# EAGLE schematic calendar-module (EAGLE 7.7.0)
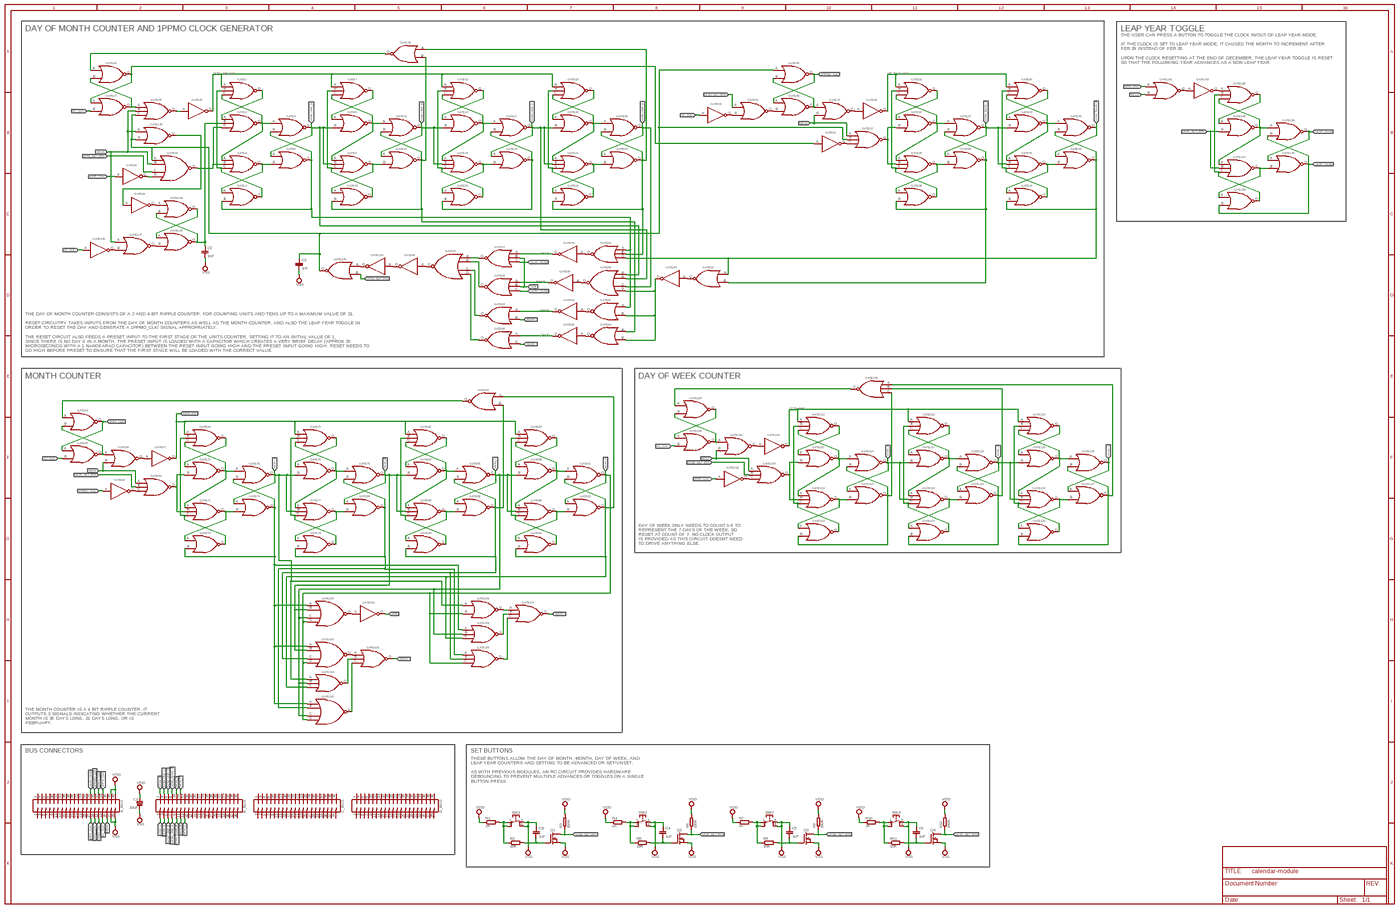
[diagram p0: schematic, sheet 1, overview]
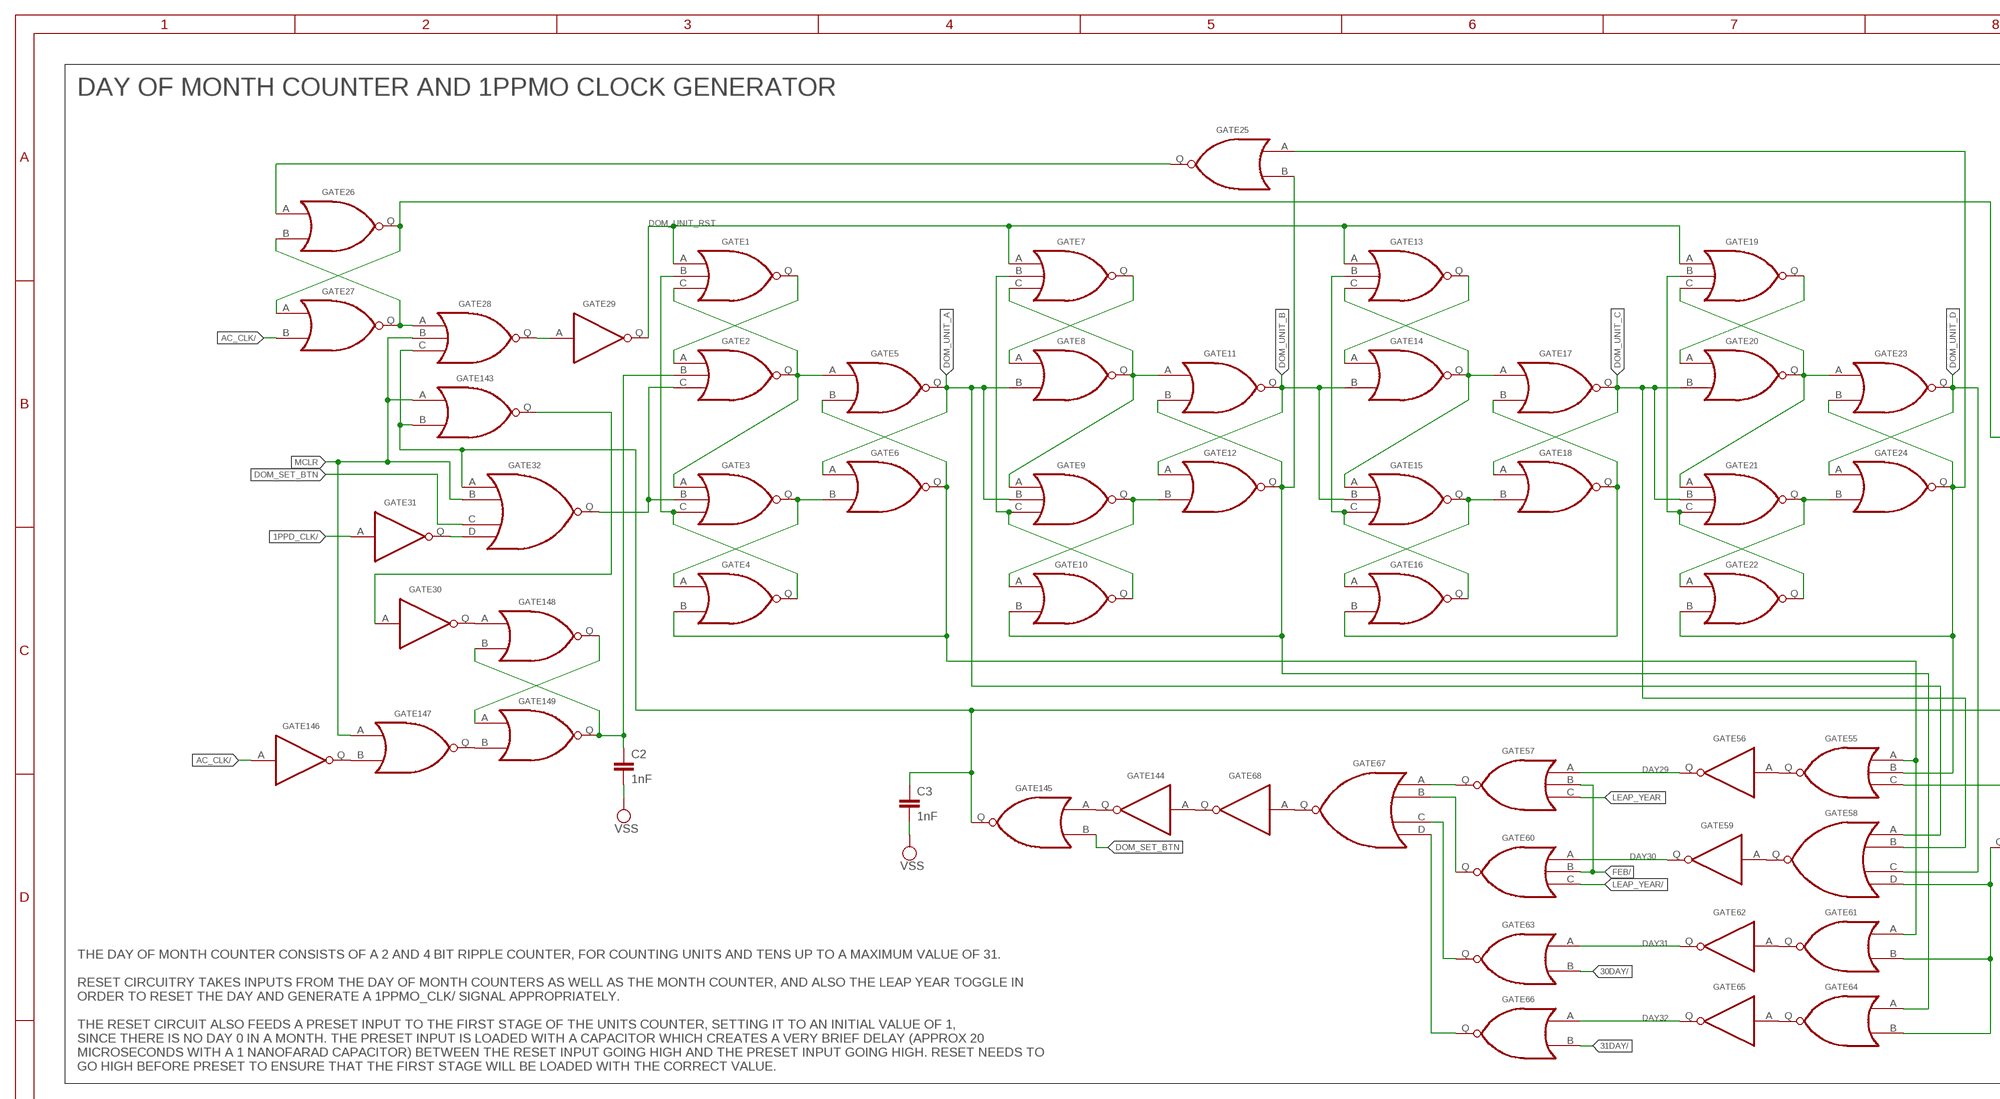
[diagram p1: schematic, sheet 1, part 1 of 4]
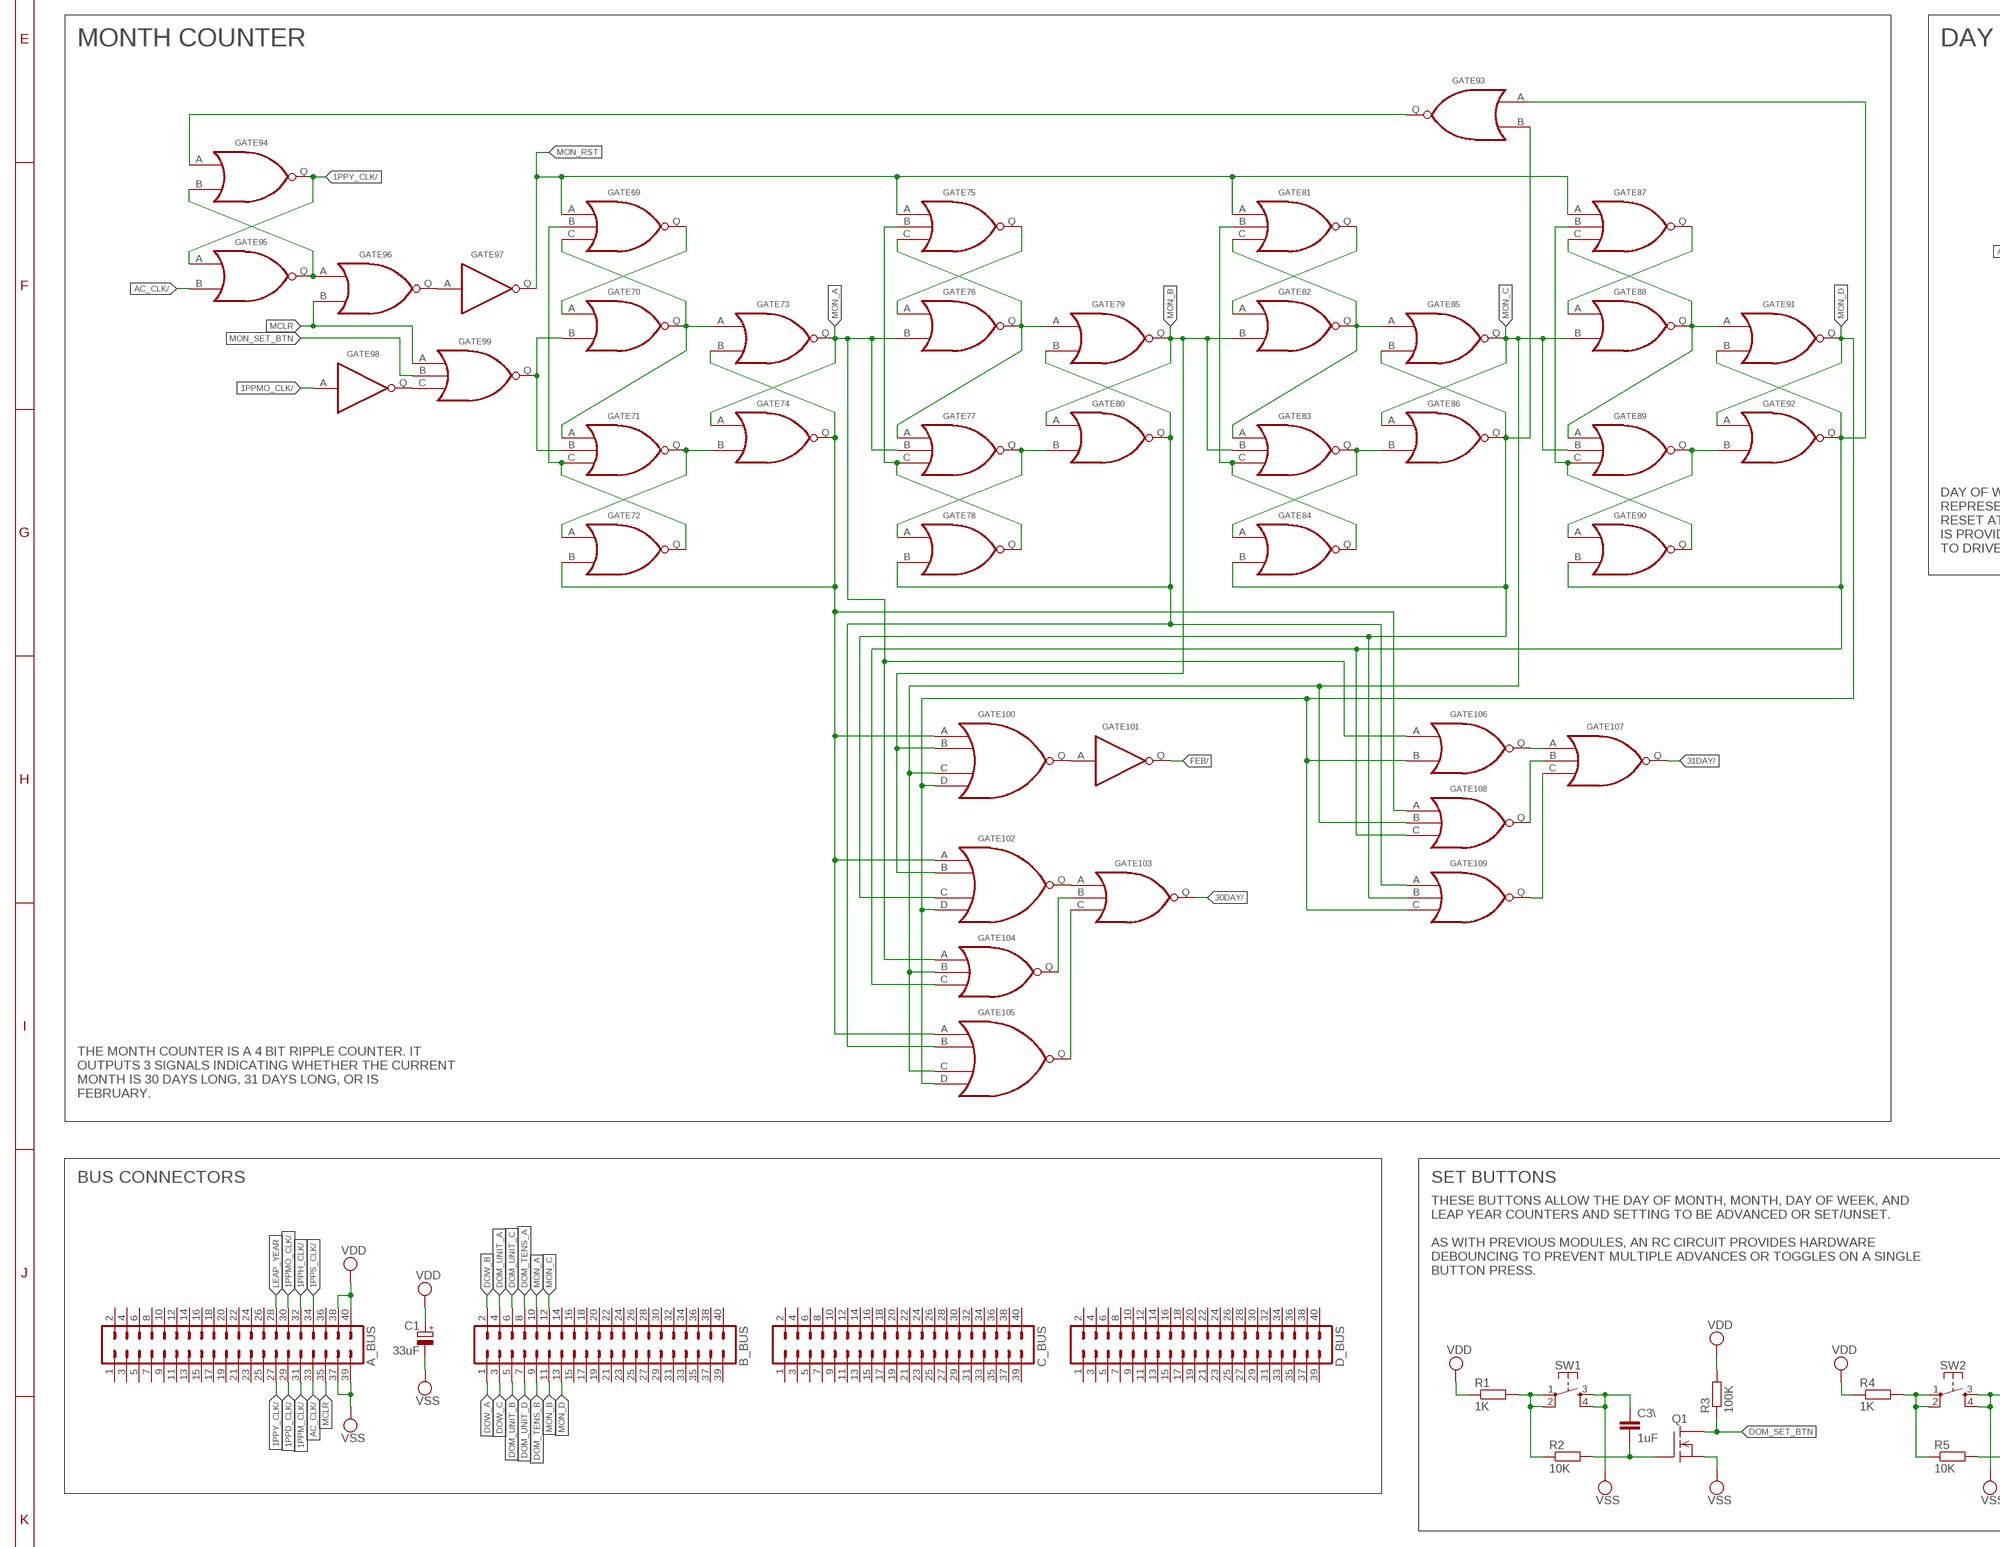
[diagram p2: schematic, sheet 1, part 2 of 4]
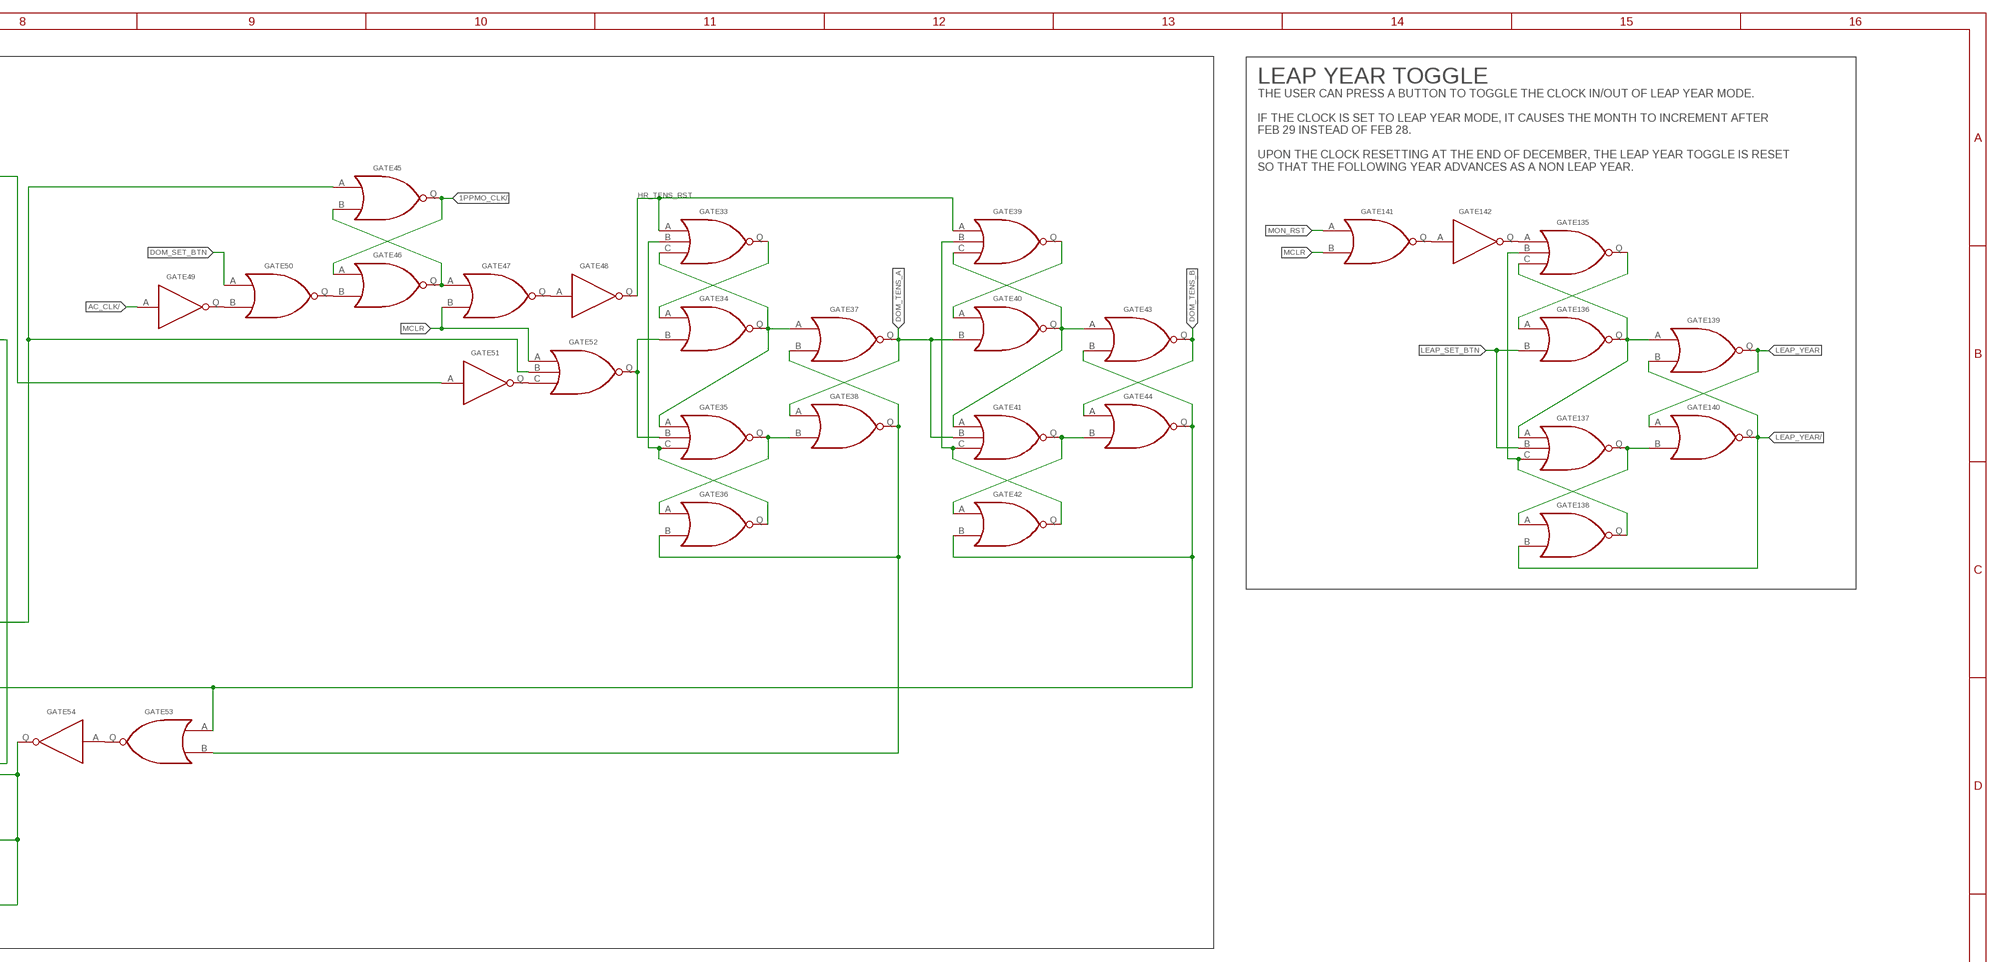
[diagram p3: schematic, sheet 1, part 3 of 4]
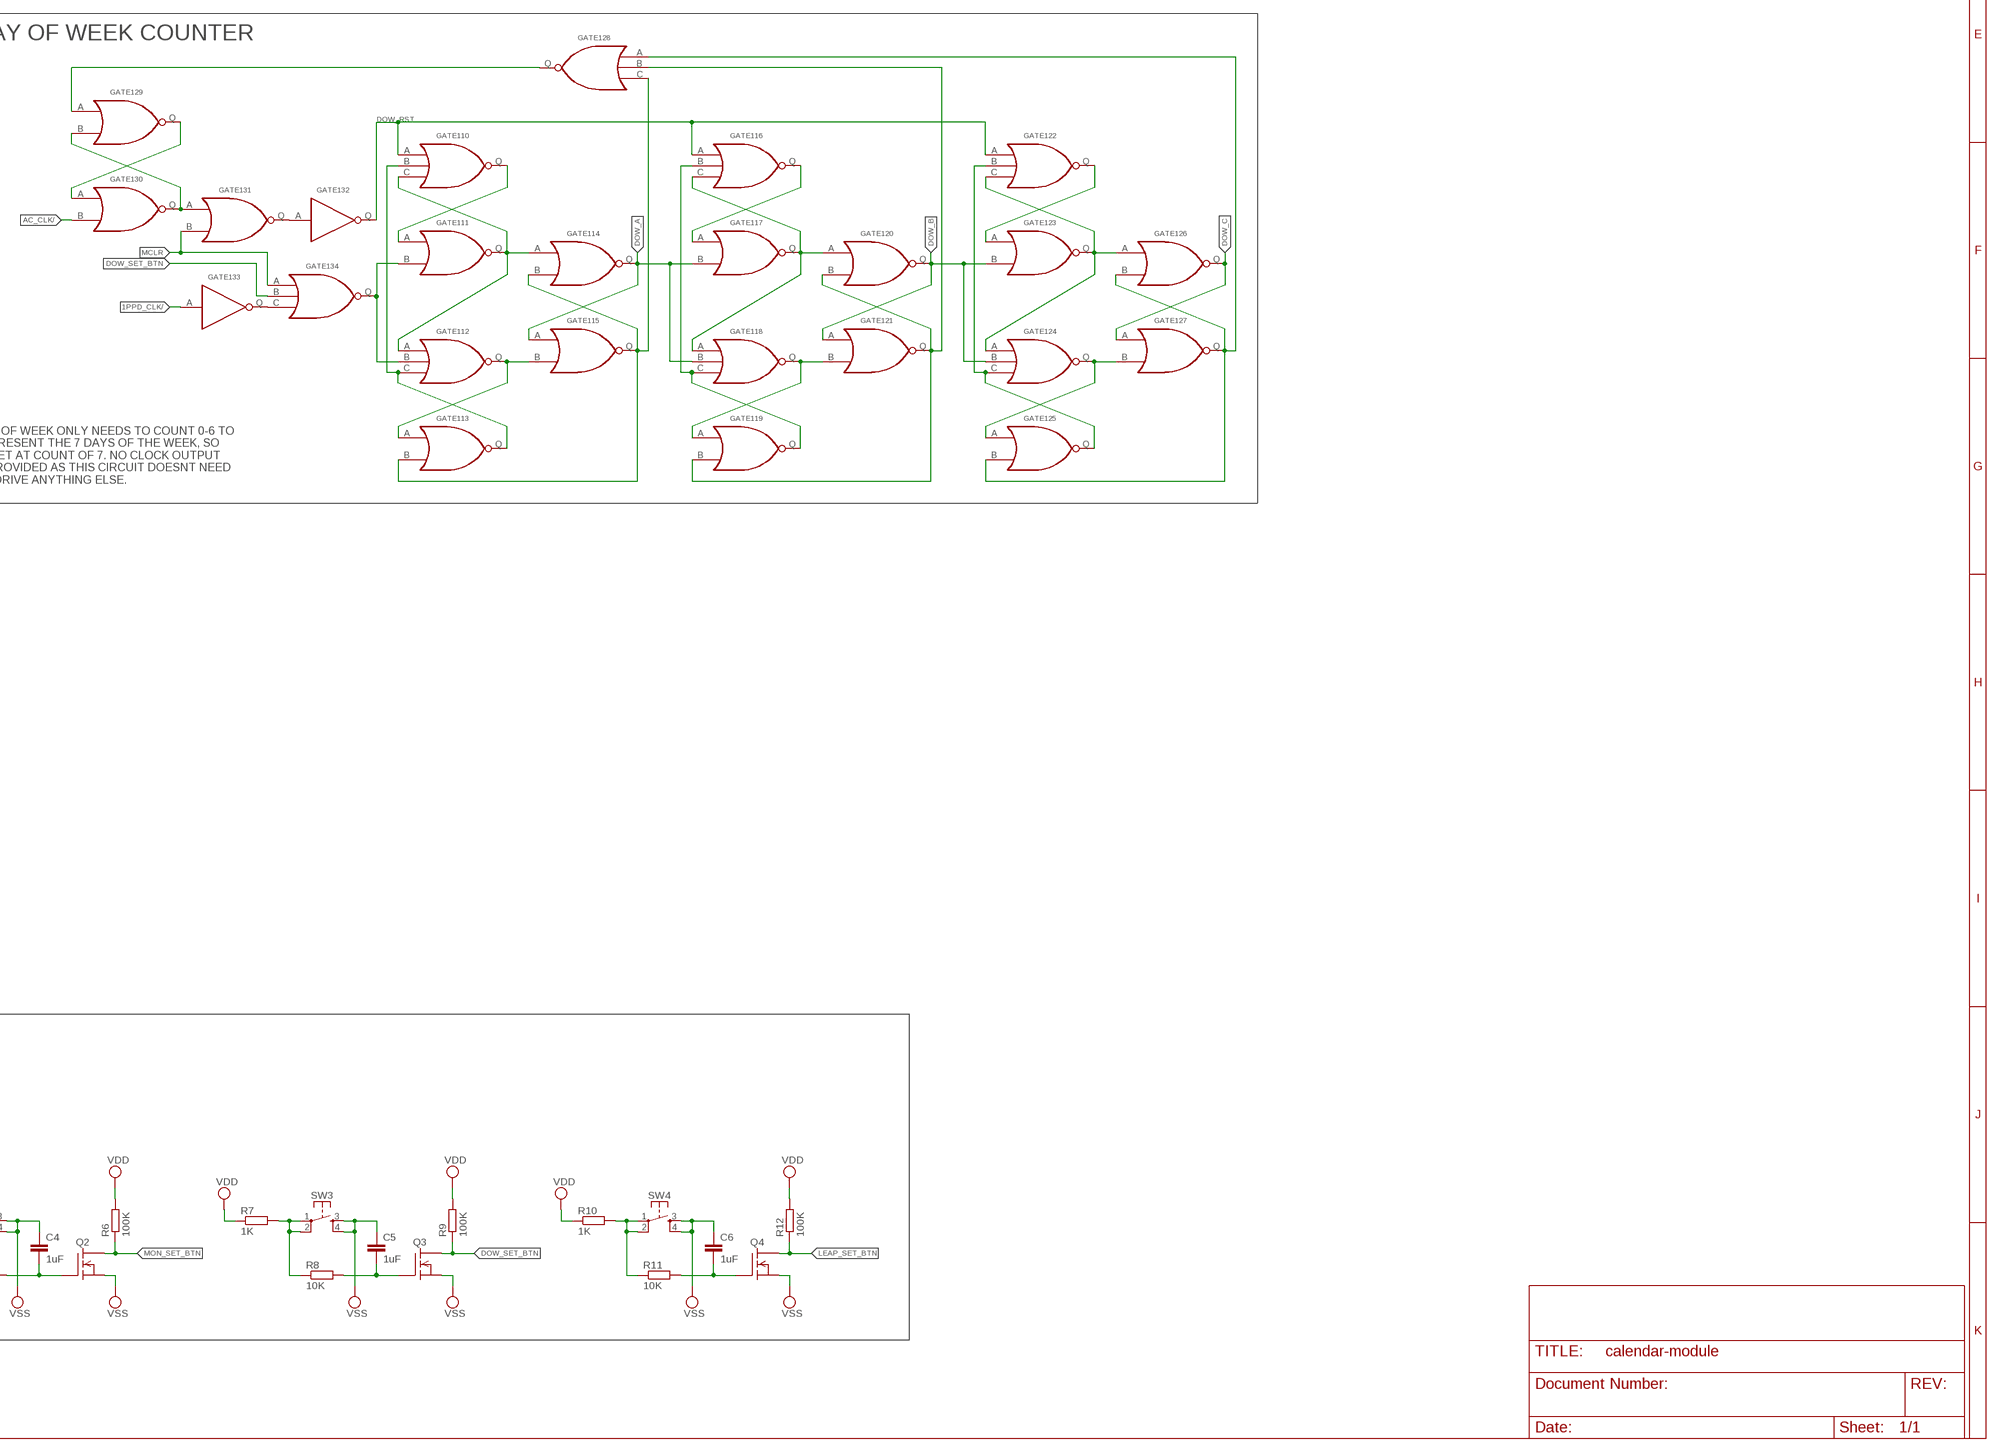
[diagram p4: schematic, sheet 1, part 4 of 4]

## Parts
A_BUS  MA20-2  [MA20-2]
B_BUS  MA20-2  [MA20-2]
C1  33uF  CPOL-EUE2.5-6  [E2,5-6]
C2  1nF  C-EU050-025X075  [C050-025X075]
C3  1nF  C-EU050-025X075  [C050-025X075]
C3\  1uF  C-EU050-025X075  [C050-025X075]
C4  1uF  C-EU050-025X075  [C050-025X075]
C5  1uF  C-EU050-025X075  [C050-025X075]
C6  1uF  C-EU050-025X075  [C050-025X075]
C_BUS  MA20-2  [MA20-2]
D_BUS  MA20-2  [MA20-2]
GATE1  3NOR  [3NOR]
GATE2  3NOR  [3NOR]
GATE3  3NOR  [3NOR]
GATE4  2NOR  [2NOR]
GATE5  2NOR  [2NOR]
GATE6  2NOR  [2NOR]
GATE7  3NOR  [3NOR]
GATE8  2NOR  [2NOR]
GATE9  3NOR  [3NOR]
GATE10  2NOR  [2NOR]
GATE11  2NOR  [2NOR]
GATE12  2NOR  [2NOR]
GATE13  3NOR  [3NOR]
GATE14  2NOR  [2NOR]
GATE15  3NOR  [3NOR]
GATE16  2NOR  [2NOR]
GATE17  2NOR  [2NOR]
GATE18  2NOR  [2NOR]
GATE19  3NOR  [3NOR]
GATE20  2NOR  [2NOR]
GATE21  3NOR  [3NOR]
GATE22  2NOR  [2NOR]
GATE23  2NOR  [2NOR]
GATE24  2NOR  [2NOR]
GATE25  2NOR  [2NOR]
GATE26  2NOR  [2NOR]
GATE27  2NOR  [2NOR]
GATE28  3NOR  [3NOR]
GATE29  INVERTER  [INVERTER]
GATE30  INVERTER  [INVERTER]
GATE31  INVERTER  [INVERTER]
GATE32  4NOR  [4NOR]
GATE33  3NOR  [3NOR]
GATE34  2NOR  [2NOR]
GATE35  3NOR  [3NOR]
GATE36  2NOR  [2NOR]
GATE37  2NOR  [2NOR]
GATE38  2NOR  [2NOR]
GATE39  3NOR  [3NOR]
GATE40  2NOR  [2NOR]
GATE41  3NOR  [3NOR]
GATE42  2NOR  [2NOR]
GATE43  2NOR  [2NOR]
GATE44  2NOR  [2NOR]
GATE45  2NOR  [2NOR]
GATE46  2NOR  [2NOR]
GATE47  2NOR  [2NOR]
GATE48  INVERTER  [INVERTER]
GATE49  INVERTER  [INVERTER]
GATE50  2NOR  [2NOR]
GATE51  INVERTER  [INVERTER]
GATE52  3NOR  [3NOR]
GATE53  2NOR  [2NOR]
GATE54  INVERTER  [INVERTER]
GATE55  3NOR  [3NOR]
GATE56  INVERTER  [INVERTER]
GATE57  3NOR  [3NOR]
GATE58  4NOR  [4NOR]
GATE59  INVERTER  [INVERTER]
GATE60  3NOR  [3NOR]
GATE61  2NOR  [2NOR]
GATE62  INVERTER  [INVERTER]
GATE63  2NOR  [2NOR]
GATE64  2NOR  [2NOR]
GATE65  INVERTER  [INVERTER]
GATE66  2NOR  [2NOR]
GATE67  4NOR  [4NOR]
GATE68  INVERTER  [INVERTER]
GATE69  3NOR  [3NOR]
GATE70  2NOR  [2NOR]
GATE71  3NOR  [3NOR]
GATE72  2NOR  [2NOR]
GATE73  2NOR  [2NOR]
GATE74  2NOR  [2NOR]
GATE75  3NOR  [3NOR]
GATE76  2NOR  [2NOR]
GATE77  3NOR  [3NOR]
GATE78  2NOR  [2NOR]
GATE79  2NOR  [2NOR]
GATE80  2NOR  [2NOR]
GATE81  3NOR  [3NOR]
GATE82  2NOR  [2NOR]
GATE83  3NOR  [3NOR]
GATE84  2NOR  [2NOR]
GATE85  2NOR  [2NOR]
GATE86  2NOR  [2NOR]
GATE87  3NOR  [3NOR]
GATE88  2NOR  [2NOR]
GATE89  3NOR  [3NOR]
GATE90  2NOR  [2NOR]
GATE91  2NOR  [2NOR]
GATE92  2NOR  [2NOR]
GATE93  2NOR  [2NOR]
GATE94  2NOR  [2NOR]
GATE95  2NOR  [2NOR]
GATE96  2NOR  [2NOR]
GATE97  INVERTER  [INVERTER]
GATE98  INVERTER  [INVERTER]
GATE99  3NOR  [3NOR]
GATE100  4NOR  [4NOR]
GATE101  INVERTER  [INVERTER]
GATE102  4NOR  [4NOR]
GATE103  3NOR  [3NOR]
GATE104  3NOR  [3NOR]
GATE105  4NOR  [4NOR]
GATE106  2NOR  [2NOR]
GATE107  3NOR  [3NOR]
GATE108  3NOR  [3NOR]
GATE109  3NOR  [3NOR]
GATE110  3NOR  [3NOR]
GATE111  2NOR  [2NOR]
GATE112  3NOR  [3NOR]
GATE113  2NOR  [2NOR]
GATE114  2NOR  [2NOR]
GATE115  2NOR  [2NOR]
GATE116  3NOR  [3NOR]
GATE117  2NOR  [2NOR]
GATE118  3NOR  [3NOR]
GATE119  2NOR  [2NOR]
GATE120  2NOR  [2NOR]
GATE121  2NOR  [2NOR]
GATE122  3NOR  [3NOR]
GATE123  2NOR  [2NOR]
GATE124  3NOR  [3NOR]
GATE125  2NOR  [2NOR]
GATE126  2NOR  [2NOR]
GATE127  2NOR  [2NOR]
GATE128  3NOR  [3NOR]
GATE129  2NOR  [2NOR]
GATE130  2NOR  [2NOR]
GATE131  2NOR  [2NOR]
GATE132  INVERTER  [INVERTER]
GATE133  INVERTER  [INVERTER]
GATE134  3NOR  [3NOR]
GATE135  3NOR  [3NOR]
GATE136  2NOR  [2NOR]
GATE137  3NOR  [3NOR]
GATE138  2NOR  [2NOR]
GATE139  2NOR  [2NOR]
GATE140  2NOR  [2NOR]
GATE141  2NOR  [2NOR]
GATE142  INVERTER  [INVERTER]
GATE143  2NOR  [2NOR]
GATE144  INVERTER  [INVERTER]
GATE145  2NOR  [2NOR]
GATE146  INVERTER  [INVERTER]
GATE147  2NOR  [2NOR]
GATE148  2NOR  [2NOR]
GATE149  2NOR  [2NOR]
Q1  2N7000  [TO-92]
Q2  2N7000  [TO-92]
Q3  2N7000  [TO-92]
Q4  2N7000  [TO-92]
R1  1K  R-EU_0207/2V  [0207/2V]
R2  10K  R-EU_0207/2V  [0207/2V]
R3  100K  R-EU_0207/2V  [0207/2V]
R4  1K  R-EU_0207/2V  [0207/2V]
R5  10K  R-EU_0207/2V  [0207/2V]
R6  100K  R-EU_0207/2V  [0207/2V]
R7  1K  R-EU_0207/2V  [0207/2V]
R8  10K  R-EU_0207/2V  [0207/2V]
R9  100K  R-EU_0207/2V  [0207/2V]
R10  1K  R-EU_0207/2V  [0207/2V]
R11  10K  R-EU_0207/2V  [0207/2V]
R12  100K  R-EU_0207/2V  [0207/2V]
SW1  SPST-TACSWITCH  [TE-SMD-TACSWITCH]
SW2  SPST-TACSWITCH  [TE-SMD-TACSWITCH]
SW3  SPST-TACSWITCH  [TE-SMD-TACSWITCH]
SW4  SPST-TACSWITCH  [TE-SMD-TACSWITCH]

## Nets
1PPD_CLK/: A_BUS.29 GATE31.A GATE133.A
1PPH_CLK/: A_BUS.32
1PPM_CLK/: A_BUS.31
1PPMO_CLK/: A_BUS.30 GATE45.Q GATE46.A GATE98.A
1PPS_CLK/: A_BUS.34
1PPY_CLK/: A_BUS.27 GATE94.Q GATE95.A
30DAY/: GATE63.B GATE103.Q
31DAY/: GATE66.B GATE107.Q
AC_CLK/: A_BUS.33 GATE27.B GATE49.A GATE95.B GATE130.B GATE146.A
DAY29: GATE56.Q GATE57.A
DAY30: GATE59.Q GATE60.A
DAY31: GATE62.Q GATE63.A
DAY32: GATE65.Q GATE66.A
DOM_RESET: C3.1 GATE28.C GATE32.A GATE45.A GATE52.B GATE143.B GATE145.Q
DOM_SET_BTN: GATE32.C GATE50.A GATE145.B Q1.3(D) R3.1
DOM_TENS_A: B_BUS.8 GATE37.Q GATE38.A GATE40.B GATE41.B
DOM_TENS_B: B_BUS.9 GATE43.Q GATE44.A
DOM_UNIT_A: B_BUS.4 GATE5.Q GATE6.A GATE8.B GATE9.B GATE58.A
DOM_UNIT_B: B_BUS.5 GATE11.Q GATE12.A GATE14.B GATE15.B
DOM_UNIT_C: B_BUS.6 GATE17.Q GATE18.A GATE20.B GATE21.B GATE58.B
DOM_UNIT_D: B_BUS.7 GATE23.Q GATE24.A GATE58.C
DOM_UNIT_RST: GATE1.A GATE7.A GATE13.A GATE19.A GATE29.Q
DOM_UNIT_RST/: GATE26.Q GATE27.A GATE51.A
DOW_A: B_BUS.1 GATE114.Q GATE115.A GATE117.B GATE118.B
DOW_B: B_BUS.2 GATE120.Q GATE121.A GATE123.B GATE124.B
DOW_C: B_BUS.3 GATE126.Q GATE127.A
DOW_RST: GATE110.A GATE116.A GATE122.A GATE132.Q
DOW_SET_BTN: GATE134.B Q3.3(D) R9.1
FEB/: GATE57.B GATE60.B GATE101.Q
HR_TENS_RST: GATE33.A GATE39.A GATE48.Q
LEAP_SET_BTN: GATE136.B GATE137.B Q4.3(D) R12.1
LEAP_YEAR: A_BUS.28 GATE57.C GATE139.Q GATE140.A
LEAP_YEAR/: GATE60.C GATE138.B GATE139.B GATE140.Q
MCLR: A_BUS.35 GATE28.B GATE32.B GATE47.B GATE52.A GATE96.B GATE99.A GATE131.B GATE134.A GATE141.B GATE143.A GATE147.A
MON_A: B_BUS.10 GATE73.Q GATE74.A GATE76.B GATE77.B GATE104.A GATE106.A
MON_B: B_BUS.11 GATE79.Q GATE80.A GATE82.B GATE83.B GATE100.B GATE102.B
MON_C: B_BUS.12 GATE85.Q GATE86.A GATE88.B GATE89.B GATE100.C GATE104.B GATE105.C GATE108.B
MON_D: B_BUS.13 GATE91.Q GATE92.A GATE100.D GATE102.D GATE105.D GATE106.B GATE109.C
MON_RST: GATE69.A GATE75.A GATE81.A GATE87.A GATE97.Q GATE141.A
MON_SET_BTN: GATE99.B Q2.3(D) R6.1
N$1: GATE28.Q GATE29.A
N$2: GATE45.B GATE46.Q GATE47.A
N$3: GATE47.Q GATE48.A
N$4: GATE129.B GATE130.Q GATE131.A
N$5: GATE46.B GATE50.Q
N$6: GATE49.Q GATE50.B
N$7: GATE51.Q GATE52.C
N$8: GATE53.Q GATE54.A
N$9: GATE58.Q GATE59.A
N$10: GATE61.Q GATE62.A
N$11: GATE96.Q GATE97.A
N$12: GATE2.C GATE3.B GATE32.Q
N$13: GATE98.Q GATE99.C
N$14: GATE69.C GATE70.Q GATE71.A GATE73.A
N$15: GATE69.Q GATE70.A
N$16: GATE69.B GATE71.C GATE72.Q
N$17: GATE71.Q GATE72.A GATE74.B
N$18: GATE72.B GATE73.B GATE74.Q GATE100.A GATE102.A GATE105.A GATE108.A
N$19: GATE75.C GATE76.Q GATE77.A GATE79.A
N$20: GATE75.Q GATE76.A
N$21: GATE75.B GATE77.C GATE78.Q
N$22: GATE77.Q GATE78.A GATE80.B
N$23: GATE78.B GATE79.B GATE80.Q GATE105.B GATE109.A
N$24: GATE81.C GATE82.Q GATE83.A GATE85.A
N$25: GATE81.Q GATE82.A
N$26: GATE100.Q GATE101.A
N$27: GATE81.B GATE83.C GATE84.Q
N$28: GATE83.Q GATE84.A GATE86.B
N$29: GATE84.B GATE85.B GATE86.Q GATE93.B GATE102.C GATE109.B
N$30: GATE87.C GATE88.Q GATE89.A GATE91.A
N$31: GATE54.Q GATE58.D GATE61.B GATE64.B
N$32: GATE87.Q GATE88.A
N$33: GATE87.B GATE89.C GATE90.Q
N$34: GATE89.Q GATE90.A GATE92.B
N$35: GATE90.B GATE91.B GATE92.Q GATE93.A GATE104.C GATE108.C
N$36: GATE131.Q GATE132.A
N$37: GATE94.B GATE95.Q GATE96.A
N$38: GATE146.Q GATE147.B
N$39: GATE133.Q GATE134.C
N$40: GATE135.A GATE142.Q
N$41: GATE103.B GATE104.Q
N$42: GATE103.C GATE105.Q
N$43: GATE106.Q GATE107.A
N$44: GATE107.B GATE108.Q
N$45: GATE107.C GATE109.Q
N$46: GATE26.B GATE27.Q GATE28.A
N$47: GATE31.Q GATE32.D
N$48: GATE34.B GATE35.B GATE52.Q
N$49: GATE110.C GATE111.Q GATE112.A GATE114.A
N$50: GATE110.Q GATE111.A
N$51: GATE110.B GATE112.C GATE113.Q
N$52: GATE112.Q GATE113.A GATE115.B
N$53: GATE93.Q GATE94.A
N$54: GATE113.B GATE114.B GATE115.Q GATE128.C
N$55: GATE116.C GATE117.Q GATE118.A GATE120.A
N$56: GATE116.Q GATE117.A
N$57: GATE148.Q GATE149.A
N$58: GATE116.B GATE118.C GATE119.Q
N$59: GATE118.Q GATE119.A GATE121.B
N$60: GATE119.B GATE120.B GATE121.Q GATE128.B
N$61: GATE122.C GATE123.Q GATE124.A GATE126.A
N$62: C2.1 GATE2.B GATE148.B GATE149.Q
N$63: GATE122.Q GATE123.A
N$64: GATE122.B GATE124.C GATE125.Q
N$65: GATE124.Q GATE125.A GATE127.B
N$66: GATE57.Q GATE67.A
N$67: GATE60.Q GATE67.B
N$68: GATE63.Q GATE67.C
N$69: GATE68.Q GATE144.A
N$70: GATE144.Q GATE145.A
N$71: GATE125.B GATE126.B GATE127.Q GATE128.A
N$72: GATE128.Q GATE129.A
N$73: GATE66.Q GATE67.D
N$74: GATE55.Q GATE56.A
N$75: GATE70.B GATE71.B GATE99.Q
N$76: GATE147.Q GATE149.B
N$77: GATE129.Q GATE130.A
N$78: GATE102.Q GATE103.A
N$79: GATE111.B GATE112.B GATE134.Q
N$80: GATE135.C GATE136.Q GATE137.A GATE139.A
N$81: GATE135.Q GATE136.A
N$82: GATE135.B GATE137.C GATE138.Q
N$83: GATE1.C GATE2.Q GATE3.A GATE5.A
N$84: GATE1.Q GATE2.A
N$85: GATE1.B GATE3.C GATE4.Q
N$86: GATE3.Q GATE4.A GATE6.B
N$87: GATE4.B GATE5.B GATE6.Q GATE55.A GATE61.A
N$88: GATE7.C GATE8.Q GATE9.A GATE11.A
N$89: GATE7.Q GATE8.A
N$90: GATE7.B GATE9.C GATE10.Q
N$91: GATE9.Q GATE10.A GATE12.B
N$92: GATE10.B GATE11.B GATE12.Q GATE25.B GATE64.A
N$93: GATE13.C GATE14.Q GATE15.A GATE17.A
N$94: GATE13.Q GATE14.A
N$95: GATE13.B GATE15.C GATE16.Q
N$96: GATE15.Q GATE16.A GATE18.B
N$97: GATE16.B GATE17.B GATE18.Q
N$98: GATE19.C GATE20.Q GATE21.A GATE23.A
N$99: GATE19.Q GATE20.A
N$100: GATE19.B GATE21.C GATE22.Q
N$101: GATE21.Q GATE22.A GATE24.B
N$102: GATE22.B GATE23.B GATE24.Q GATE25.A GATE55.B
N$103: GATE25.Q GATE26.A
N$104: GATE137.Q GATE138.A GATE140.B
N$105: GATE141.Q GATE142.A
N$106: GATE64.Q GATE65.A
N$107: GATE67.Q GATE68.A
N$108: GATE33.C GATE34.Q GATE35.A GATE37.A
N$109: GATE33.Q GATE34.A
N$110: GATE33.B GATE35.C GATE36.Q
N$111: GATE35.Q GATE36.A GATE38.B
N$112: GATE36.B GATE37.B GATE38.Q GATE53.B
N$113: GATE39.C GATE40.Q GATE41.A GATE43.A
N$114: GATE39.Q GATE40.A
N$115: GATE39.B GATE41.C GATE42.Q
N$116: GATE41.Q GATE42.A GATE44.B
N$117: GATE30.Q GATE148.A
N$118: R4.2 R5.1 SW2.1 SW2.2
N$119: C4.2 Q2.2(G) R5.2
N$120: GATE42.B GATE43.B GATE44.Q GATE53.A GATE55.C
N$121: R7.2 R8.1 SW3.1 SW3.2
N$122: R1.2 R2.1 SW1.1 SW1.2
N$123: C5.2 Q3.2(G) R8.2
N$124: R10.2 R11.1 SW4.1 SW4.2
N$125: C6.2 Q4.2(G) R11.2
N$126: GATE30.A GATE143.Q
N$133: C3\.2 Q1.2(G) R2.2
VDD: A_BUS.38 A_BUS.40 C1.+ R1.1 R3.2 R4.1 R6.2 R7.1 R9.2 R10.1 R12.2
VSS: A_BUS.37 A_BUS.39 C1.- C2.2 C3.2 C3\.1 C4.1 C5.1 C6.1 Q1.1(S) Q2.1(S) Q3.1(S) Q4.1(S) SW1.3 SW1.4 SW2.3 SW2.4 SW3.3 SW3.4 SW4.3 SW4.4
Unconnected: A_BUS.1 A_BUS.2 A_BUS.3 A_BUS.4 A_BUS.5 A_BUS.6 A_BUS.7 A_BUS.8 A_BUS.9 A_BUS.10 A_BUS.11 A_BUS.12 A_BUS.13 A_BUS.14 A_BUS.15 A_BUS.16 A_BUS.17 A_BUS.18 A_BUS.19 A_BUS.20 A_BUS.21 A_BUS.22 A_BUS.23 A_BUS.24 A_BUS.25 A_BUS.26 A_BUS.36 B_BUS.14 B_BUS.15 B_BUS.16 B_BUS.17 B_BUS.18 B_BUS.19 B_BUS.20 B_BUS.21 B_BUS.22 B_BUS.23 B_BUS.24 B_BUS.25 B_BUS.26 B_BUS.27 B_BUS.28 B_BUS.29 B_BUS.30 B_BUS.31 B_BUS.32 B_BUS.33 B_BUS.34 B_BUS.35 B_BUS.36 B_BUS.37 B_BUS.38 B_BUS.39 B_BUS.40 C_BUS.1 C_BUS.2 C_BUS.3 C_BUS.4 C_BUS.5 C_BUS.6 C_BUS.7 C_BUS.8 C_BUS.9 C_BUS.10 C_BUS.11 C_BUS.12 C_BUS.13 C_BUS.14 C_BUS.15 C_BUS.16 C_BUS.17 C_BUS.18 C_BUS.19 C_BUS.20 C_BUS.21 C_BUS.22 C_BUS.23 C_BUS.24 C_BUS.25 C_BUS.26 C_BUS.27 C_BUS.28 C_BUS.29 C_BUS.30 C_BUS.31 C_BUS.32 C_BUS.33 C_BUS.34 C_BUS.35 C_BUS.36 C_BUS.37 C_BUS.38 C_BUS.39 C_BUS.40 D_BUS.1 D_BUS.2 D_BUS.3 D_BUS.4 D_BUS.5 D_BUS.6 D_BUS.7 D_BUS.8 D_BUS.9 D_BUS.10 D_BUS.11 D_BUS.12 D_BUS.13 D_BUS.14 D_BUS.15 D_BUS.16 D_BUS.17 D_BUS.18 D_BUS.19 D_BUS.20 D_BUS.21 D_BUS.22 D_BUS.23 D_BUS.24 D_BUS.25 D_BUS.26 D_BUS.27 D_BUS.28 D_BUS.29 D_BUS.30 D_BUS.31 D_BUS.32 D_BUS.33 D_BUS.34 D_BUS.35 D_BUS.36 D_BUS.37 D_BUS.38 D_BUS.39 D_BUS.40

## Notes on the sheet
- DAY OF MONTH COUNTER AND 1PPMO CLOCK GENERATOR | LEAP YEAR TOGGLE
- THE USER CAN PRESS A BUTTON TO TOGGLE THE CLOCK IN/OUT OF LEAP YEAR MODE.
  
  IF THE CLOCK IS SET TO LEAP YEAR MODE, IT CAUSES THE MONTH TO INCREMENT AFTER
  FEB 29 INSTEAD OF FEB 28.
  
  UPON THE CLOCK RESETTING AT THE END OF DECEMBER, THE LEAP YEAR TOGGLE IS RESET
  SO THAT THE FOLLOWING YEAR ADVANCES AS A NON LEAP YEAR.
- THE DAY OF MONTH COUNTER CONSISTS OF A 2 AND 4 BIT RIPPLE COUNTER, FOR COUNTING UNITS AND TENS UP TO A MAXIMUM VALUE OF 31.
  
  RESET CIRCUITRY TAKES INPUTS FROM THE DAY OF MONTH COUNTERS AS WELL AS THE MONTH COUNTER, AND ALSO THE LEAP YEAR TOGGLE IN
  ORDER TO RESET THE DAY AND GENERATE A 1PPMO_CLK/ SIGNAL APPROPRIATELY.
  
  THE RESET CIRCUIT ALSO FEEDS A PRESET INPUT TO THE FIRST STAGE OF THE UNITS COUNTER, SETTING IT TO AN INITIAL VALUE OF 1,
  SINCE THERE IS NO DAY 0 IN A MONTH. THE PRESET INPUT IS LOADED WITH A CAPACITOR WHICH CREATES A VERY BRIEF DELAY (APPROX 20
  MICROSECONDS WITH A 1 NANOFARAD CAPACITOR) BETWEEN THE RESET INPUT GOING HIGH AND THE PRESET INPUT GOING HIGH. RESET NEEDS TO
  GO HIGH BEFORE PRESET TO ENSURE THAT THE FIRST STAGE WILL BE LOADED WITH THE CORRECT VALUE.
- MONTH COUNTER | DAY OF WEEK COUNTER
- DAY OF WEEK ONLY NEEDS TO COUNT 0-6 TO
  REPRESENT THE 7 DAYS OF THE WEEK, SO
  RESET AT COUNT OF 7. NO CLOCK OUTPUT
  IS PROVIDED AS THIS CIRCUIT DOESNT NEED
  TO DRIVE ANYTHING ELSE.
- THE MONTH COUNTER IS A 4 BIT RIPPLE COUNTER. IT
  OUTPUTS 3 SIGNALS INDICATING WHETHER THE CURRENT
  MONTH IS 30 DAYS LONG, 31 DAYS LONG, OR IS
  FEBRUARY.
- BUS CONNECTORS | SET BUTTONS
- THESE BUTTONS ALLOW THE DAY OF MONTH, MONTH, DAY OF WEEK, AND
  LEAP YEAR COUNTERS AND SETTING TO BE ADVANCED OR SET/UNSET.
  
  AS WITH PREVIOUS MODULES, AN RC CIRCUIT PROVIDES HARDWARE
  DEBOUNCING TO PREVENT MULTIPLE ADVANCES OR TOGGLES ON A SINGLE
  BUTTON PRESS.

## Library data of the parts
A_BUS B_BUS C_BUS D_BUS = con-lstb:MA20-2: PIN HEADER; OC_FARNELL: unknown; OC_NEWARK: unknown
C1 = rcl:CPOL-EU: POLARIZED CAPACITOR, European symbol
C2 C3 C3\ C4-C6 = rcl:C-EU: CAPACITOR, European symbol
GATE1-GATE3 GATE7 GATE9 GATE13 GATE15 GATE19 GATE21 GATE28 GATE33 GATE35 GATE39 GATE41 GATE52 GATE55 GATE57 GATE60 GATE69 GATE71 GATE75 GATE77 GATE81 GATE83 GATE87 GATE89 GATE99 GATE103 GATE104 GATE107-GATE110 GATE112 GATE116 GATE118 GATE122 GATE124 GATE128 GATE134 GATE135 GATE137 = NOR gate clock:3NOR
GATE4-GATE6 GATE8 GATE10-GATE12 GATE14 GATE16-GATE18 GATE20 GATE22-GATE27 GATE34 GATE36-GATE38 GATE40 GATE42-GATE47 GATE50 GATE53 GATE61 GATE63 GATE64 GATE66 GATE70 GATE72-GATE74 GATE76 GATE78-GATE80 GATE82 GATE84-GATE86 GATE88 GATE90-GATE96 GATE106 GATE111 GATE113-GATE115 GATE117 GATE119-GATE121 GATE123 GATE125-GATE127 GATE129-GATE131 GATE136 GATE138-GATE141 GATE143 GATE145 GATE147-GATE149 = NOR gate clock:2NOR
GATE29-GATE31 GATE48 GATE49 GATE51 GATE54 GATE56 GATE59 GATE62 GATE65 GATE68 GATE97 GATE98 GATE101 GATE132 GATE133 GATE142 GATE144 GATE146 = NOR gate clock:INVERTER
GATE32 GATE58 GATE67 GATE100 GATE102 GATE105 = NOR gate clock:4NOR
Q1-Q4 = NOR gate clock:2N7000: N channel MOSFET
R1-R12 = NOR gate clock:R-EU_
SW1-SW4 = Toms Library:SPST-TACSWITCH: TE SPST normally-open tactile switch. MPN: 4-1437565-1 Rating: 0.05A @ 12V